# Altium schematic sheet Peripherals.SchDoc
size C; SheetNumber: 4; SheetTotal: 4
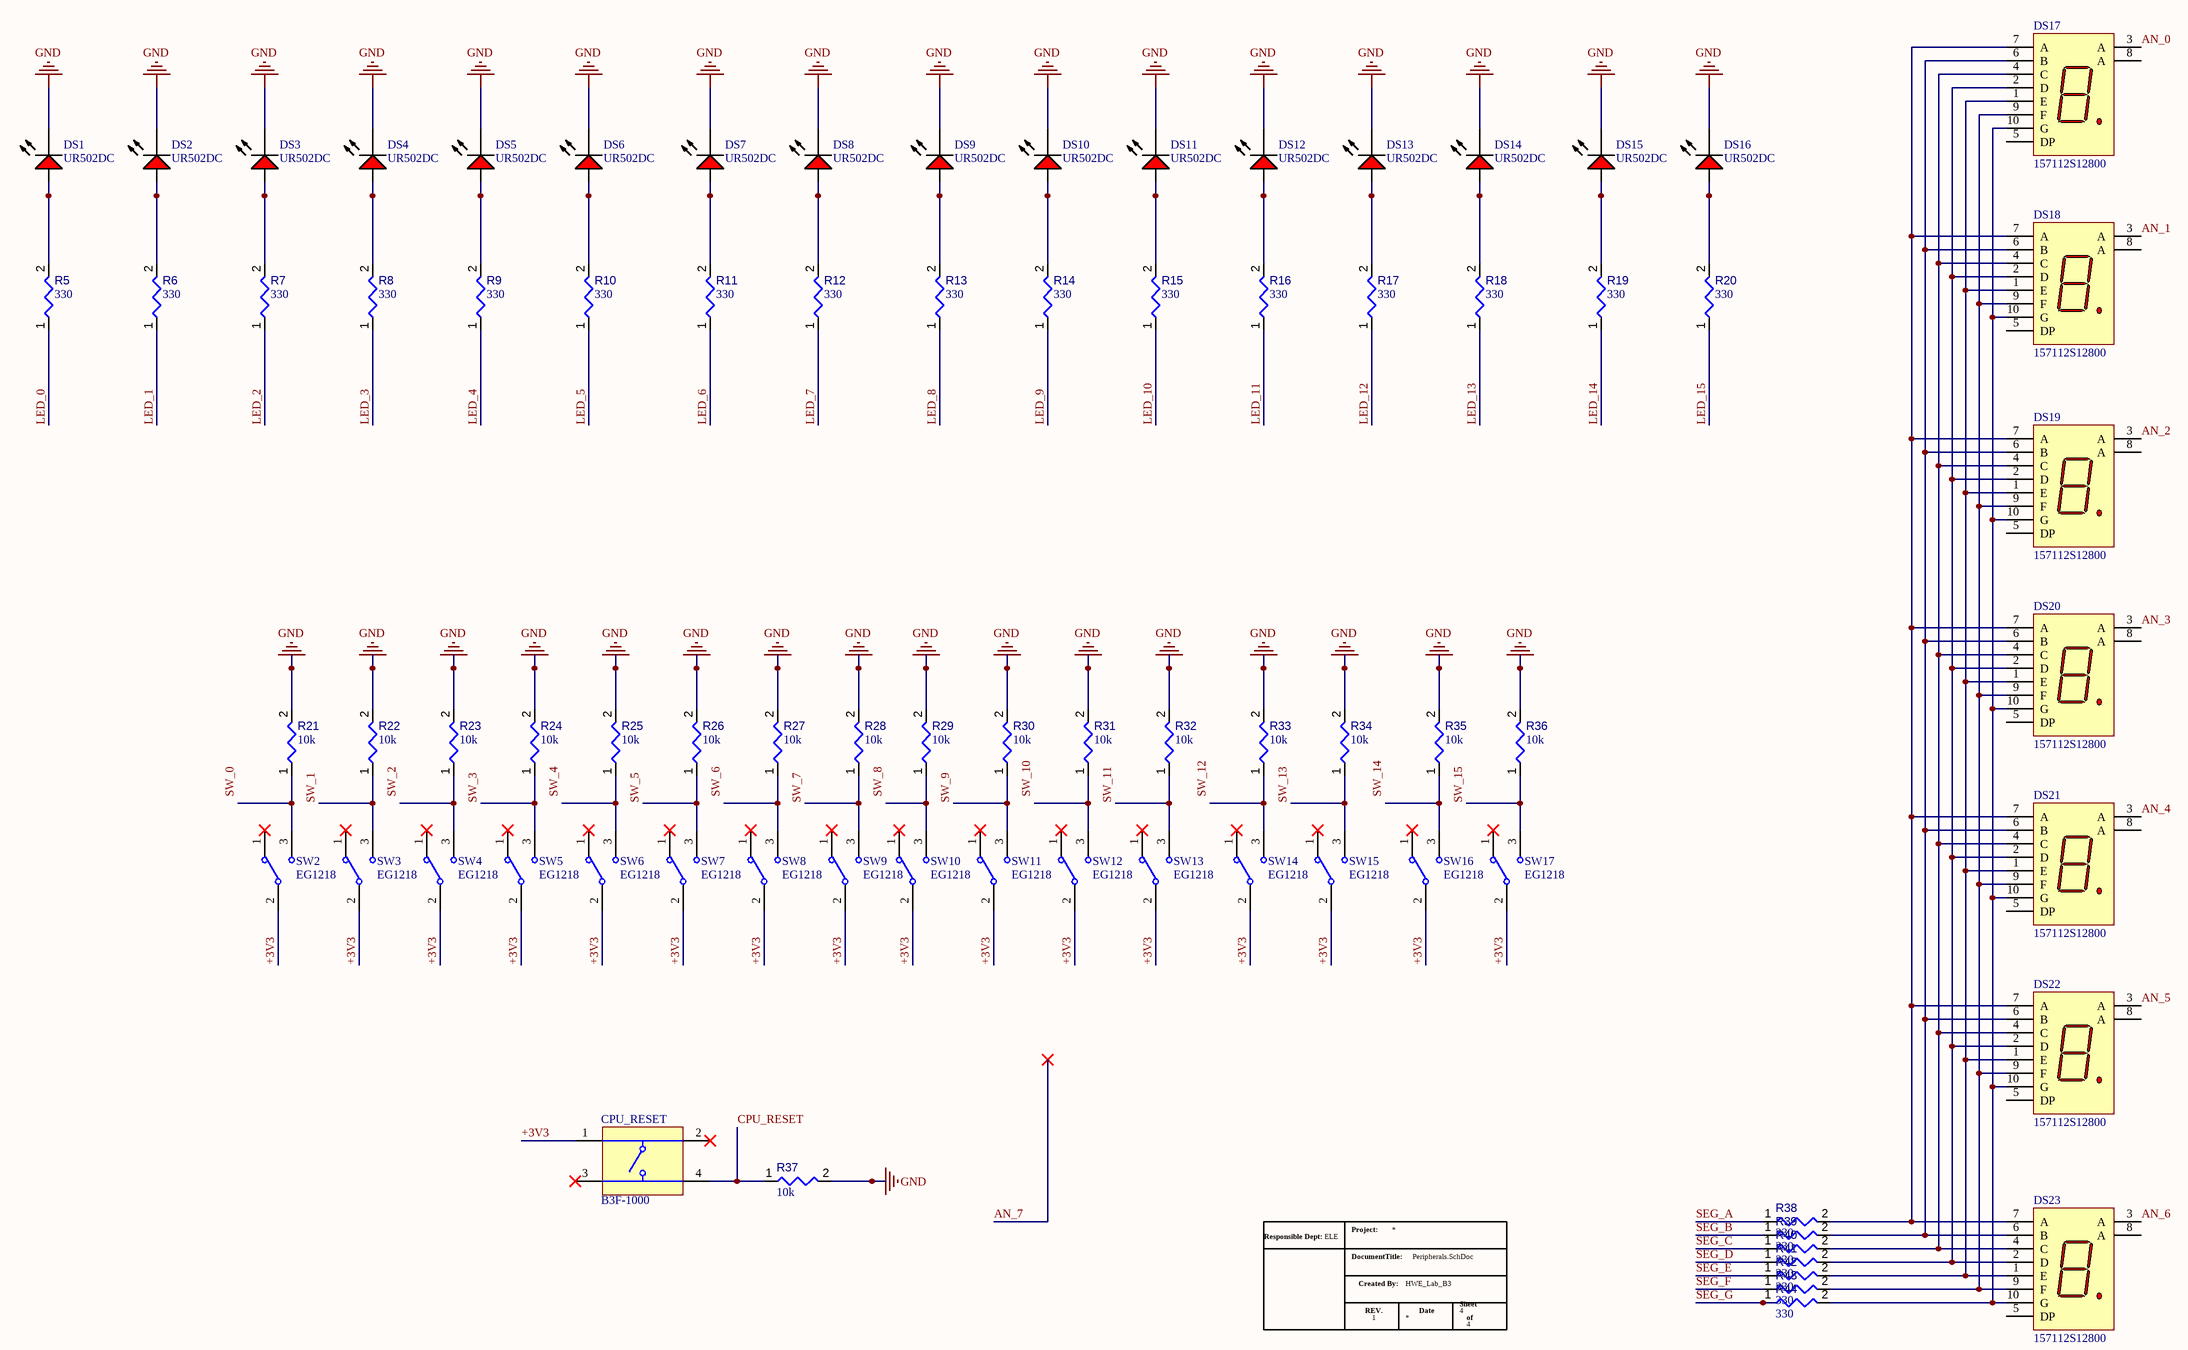
[diagram p0: Peripherals.SchDoc]

## Parts
*  8Bit_CPU  (value not drawn)  (graphical)
CPU_RESET  B3F-1000  [OMRON-B3F-1000-4_V]
DS1  UR502DC  [CGX-UR502DC]
DS2  UR502DC  [CGX-UR502DC]
DS3  UR502DC  [CGX-UR502DC]
DS4  UR502DC  [CGX-UR502DC]
DS5  UR502DC  [CGX-UR502DC]
DS6  UR502DC  [CGX-UR502DC]
DS7  UR502DC  [CGX-UR502DC]
DS8  UR502DC  [CGX-UR502DC]
DS9  UR502DC  [CGX-UR502DC]
DS10  UR502DC  [CGX-UR502DC]
DS11  UR502DC  [CGX-UR502DC]
DS12  UR502DC  [CGX-UR502DC]
DS13  UR502DC  [CGX-UR502DC]
DS14  UR502DC  [CGX-UR502DC]
DS15  UR502DC  [CGX-UR502DC]
DS16  UR502DC  [CGX-UR502DC]
DS17  157112S12800  [WL-S7DS_L12W7.3H3.75]
DS18  157112S12800  [WL-S7DS_L12W7.3H3.75]
DS19  157112S12800  [WL-S7DS_L12W7.3H3.75]
DS20  157112S12800  [WL-S7DS_L12W7.3H3.75]
DS21  157112S12800  [WL-S7DS_L12W7.3H3.75]
DS22  157112S12800  [WL-S7DS_L12W7.3H3.75]
DS23  157112S12800  [WL-S7DS_L12W7.3H3.75]
R5  value 330  [RESC0402(1005)_L]  (hidden comment: Resistor 330R +/-5 % 0402 63 mW)
R6  value 330  [RESC0402(1005)_L]  (hidden comment: Resistor 330R +/-5 % 0402 63 mW)
R7  value 330  [RESC0402(1005)_L]  (hidden comment: Resistor 330R +/-5 % 0402 63 mW)
R8  value 330  [RESC0402(1005)_L]  (hidden comment: Resistor 330R +/-5 % 0402 63 mW)
R9  value 330  [RESC0402(1005)_L]  (hidden comment: Resistor 330R +/-5 % 0402 63 mW)
R10  value 330  [RESC0402(1005)_L]  (hidden comment: Resistor 330R +/-5 % 0402 63 mW)
R11  value 330  [RESC0402(1005)_L]  (hidden comment: Resistor 330R +/-5 % 0402 63 mW)
R12  value 330  [RESC0402(1005)_L]  (hidden comment: Resistor 330R +/-5 % 0402 63 mW)
R13  value 330  [RESC0402(1005)_L]  (hidden comment: Resistor 330R +/-5 % 0402 63 mW)
R14  value 330  [RESC0402(1005)_L]  (hidden comment: Resistor 330R +/-5 % 0402 63 mW)
R15  value 330  [RESC0402(1005)_L]  (hidden comment: Resistor 330R +/-5 % 0402 63 mW)
R16  value 330  [RESC0402(1005)_L]  (hidden comment: Resistor 330R +/-5 % 0402 63 mW)
R17  value 330  [RESC0402(1005)_L]  (hidden comment: Resistor 330R +/-5 % 0402 63 mW)
R18  value 330  [RESC0402(1005)_L]  (hidden comment: Resistor 330R +/-5 % 0402 63 mW)
R19  value 330  [RESC0402(1005)_L]  (hidden comment: Resistor 330R +/-5 % 0402 63 mW)
R20  value 330  [RESC0402(1005)_L]  (hidden comment: Resistor 330R +/-5 % 0402 63 mW)
R21  value 10k  [RESC0402(1005)_L]  (hidden comment: 10KR2F)
R22  value 10k  [RESC0402(1005)_L]  (hidden comment: 10KR2F)
R23  value 10k  [RESC0402(1005)_L]  (hidden comment: 10KR2F)
R24  value 10k  [RESC0402(1005)_L]  (hidden comment: 10KR2F)
R25  value 10k  [RESC0402(1005)_L]  (hidden comment: 10KR2F)
R26  value 10k  [RESC0402(1005)_L]  (hidden comment: 10KR2F)
R27  value 10k  [RESC0402(1005)_L]  (hidden comment: 10KR2F)
R28  value 10k  [RESC0402(1005)_L]  (hidden comment: 10KR2F)
R29  value 10k  [RESC0402(1005)_L]  (hidden comment: 10KR2F)
R30  value 10k  [RESC0402(1005)_L]  (hidden comment: 10KR2F)
R31  value 10k  [RESC0402(1005)_L]  (hidden comment: 10KR2F)
R32  value 10k  [RESC0402(1005)_L]  (hidden comment: 10KR2F)
R33  value 10k  [RESC0402(1005)_L]  (hidden comment: 10KR2F)
R34  value 10k  [RESC0402(1005)_L]  (hidden comment: 10KR2F)
R35  value 10k  [RESC0402(1005)_L]  (hidden comment: 10KR2F)
R36  value 10k  [RESC0402(1005)_L]  (hidden comment: 10KR2F)
R37  value 10k  [RESC0402(1005)_L]  (hidden comment: 10KR2F)
R38  value 330  [RESC0402(1005)_L]  (hidden comment: Resistor 330R +/-5 % 0402 63 mW)
R39  value 330  [RESC0402(1005)_L]  (hidden comment: Resistor 330R +/-5 % 0402 63 mW)
R40  value 330  [RESC0402(1005)_L]  (hidden comment: Resistor 330R +/-5 % 0402 63 mW)
R41  value 330  [RESC0402(1005)_L]  (hidden comment: Resistor 330R +/-5 % 0402 63 mW)
R42  value 330  [RESC0402(1005)_L]  (hidden comment: Resistor 330R +/-5 % 0402 63 mW)
R43  value 330  [RESC0402(1005)_L]  (hidden comment: Resistor 330R +/-5 % 0402 63 mW)
R44  value 330  [RESC0402(1005)_L]  (hidden comment: Resistor 330R +/-5 % 0402 63 mW)
SW2  EG1218  [ESWI-EG1218_V]
SW3  EG1218  [ESWI-EG1218_V]
SW4  EG1218  [ESWI-EG1218_V]
SW5  EG1218  [ESWI-EG1218_V]
SW6  EG1218  [ESWI-EG1218_V]
SW7  EG1218  [ESWI-EG1218_V]
SW8  EG1218  [ESWI-EG1218_V]
SW9  EG1218  [ESWI-EG1218_V]
SW10  EG1218  [ESWI-EG1218_V]
SW11  EG1218  [ESWI-EG1218_V]
SW12  EG1218  [ESWI-EG1218_V]
SW13  EG1218  [ESWI-EG1218_V]
SW14  EG1218  [ESWI-EG1218_V]
SW15  EG1218  [ESWI-EG1218_V]
SW16  EG1218  [ESWI-EG1218_V]
SW17  EG1218  [ESWI-EG1218_V]

## Nets
GND: DS1.2(K) DS2.2(K) DS3.2(K) DS4.2(K) DS5.2(K) DS6.2(K) DS7.2(K) DS8.2(K) DS9.2(K) DS10.2(K) DS11.2(K) DS12.2(K) DS13.2(K) DS14.2(K) DS15.2(K) DS16.2(K) R21.2 R22.2 R23.2 R24.2 R25.2 R26.2 R27.2 R28.2 R29.2 R30.2 R31.2 R32.2 R33.2 R34.2 R35.2 R36.2 R37.2
  SW_0: R21.1 SW2.3
  SW_2: R23.1 SW4.3
  SW_4: R25.1 SW6.3
  SW_6: R27.1 SW8.3
  SW_8: R29.1 SW10.3
  SW_10: R31.1 SW12.3
  SW_12: R33.1 SW14.3
  SW_14: R35.1 SW16.3
+3V3: CPU_RESET.1 SW2.2(COM) SW3.2(COM) SW4.2(COM) SW5.2(COM) SW6.2(COM) SW7.2(COM) SW8.2(COM) SW9.2(COM) SW10.2(COM) SW11.2(COM) SW12.2(COM) SW13.2(COM) SW14.2(COM) SW15.2(COM) SW16.2(COM) SW17.2(COM)
AN_0: DS17.3(A)
AN_1: DS18.3(A)
AN_2: DS19.3(A)
AN_3: DS20.3(A)
AN_4: DS21.3(A)
AN_5: DS22.3(A)
AN_6: DS23.3(A)
CPU_RESET: CPU_RESET.4 R37.1
LED_0: R5.1
LED_1: R6.1
LED_2: R7.1
LED_3: R8.1
LED_4: R9.1
LED_5: R10.1
LED_6: R11.1
LED_7: R12.1
LED_8: R13.1
LED_9: R14.1
LED_10: R15.1
LED_11: R16.1
LED_12: R17.1
LED_13: R18.1
LED_14: R19.1
LED_15: R20.1
SEG_A: R38.1
SEG_B: R39.1
SEG_C: R40.1
SEG_D: R41.1
SEG_E: R42.1
SEG_F: R43.1
SEG_G: R44.1
SW_1: R22.1 SW3.3
SW_3: R24.1 SW5.3
SW_5: R26.1 SW7.3
SW_7: R28.1 SW9.3
SW_9: R30.1 SW11.3
SW_11: R32.1 SW13.3
SW_13: R34.1 SW15.3
SW_15: R36.1 SW17.3
NetDS1_1: DS1.1(A) R5.2
NetDS2_1: DS2.1(A) R6.2
NetDS3_1: DS3.1(A) R7.2
NetDS4_1: DS4.1(A) R8.2
NetDS5_1: DS5.1(A) R9.2
NetDS6_1: DS6.1(A) R10.2
NetDS7_1: DS7.1(A) R11.2
NetDS8_1: DS8.1(A) R12.2
NetDS9_1: DS9.1(A) R13.2
NetDS10_1: DS10.1(A) R14.2
NetDS11_1: DS11.1(A) R15.2
NetDS12_1: DS12.1(A) R16.2
NetDS13_1: DS13.1(A) R17.2
NetDS14_1: DS14.1(A) R18.2
NetDS15_1: DS15.1(A) R19.2
NetDS16_1: DS16.1(A) R20.2
NetDS17_1: DS17.1(E) DS18.1(E) DS19.1(E) DS20.1(E) DS21.1(E) DS22.1(E) DS23.1(E) R42.2
NetDS17_2: DS17.2(D) DS18.2(D) DS19.2(D) DS20.2(D) DS21.2(D) DS22.2(D) DS23.2(D) R41.2
NetDS17_4: DS17.4(C) DS18.4(C) DS19.4(C) DS20.4(C) DS21.4(C) DS22.4(C) DS23.4(C) R40.2
NetDS17_6: DS17.6(B) DS18.6(B) DS19.6(B) DS20.6(B) DS21.6(B) DS22.6(B) DS23.6(B) R39.2
NetDS17_7: DS17.7(A) DS18.7(A) DS19.7(A) DS20.7(A) DS21.7(A) DS22.7(A) DS23.7(A) R38.2
NetDS17_9: DS17.9(F) DS18.9(F) DS19.9(F) DS20.9(F) DS21.9(F) DS22.9(F) DS23.9(F) R43.2
NetDS17_10: DS17.10(G) DS18.10(G) DS19.10(G) DS20.10(G) DS21.10(G) DS22.10(G) DS23.10(G) R44.2

Not connected (* = marked no-connect by the designer): CPU_RESET 2* 3*; DS17 5(DP) 8(A); DS18 5(DP) 8(A); DS19 5(DP) 8(A); DS20 5(DP) 8(A); DS21 5(DP) 8(A); DS22 5(DP) 8(A); DS23 5(DP) 8(A); SW2 1*; SW3 1*; SW4 1*; SW5 1*; SW6 1*; SW7 1*; SW8 1*; SW9 1*; SW10 1*; SW11 1*; SW12 1*; SW13 1*; SW14 1*; SW15 1*; SW16 1*; SW17 1*

## Notes on the sheet
- (in symbol 8Bit_CPU) Project:; Responsible Dept:; ELE; DocumentTitle:; Created By:; HWE_Lab_B3; Sheet; REV.; Date; 1; of

## Library data of the parts
CPU_RESET = CMP-1677-00002-1: Tactile Switch, SPST-NO, 0.05 A, 5 to 24 V, -25 to 70 degC, 4-Pin THD, RoHS, Bulk; Shielding: Shielded; Gender: Female; Capacitance: -45 f; Voltage Rating: 150 V; Current Rating: 1.5 A; Radiation Hardening: No; Contact Plating: Gold; Height: 14.99 mm; Min Operating Temperature: -40 degC; Packaging: Tray; ComponentLink2Description: Datasheet; ComponentLink1URL: http://www.omron.com/; Lead Pitch: 1.27 mm; RoHSCompliant: true; Pins: 8; PackageReference: B3F-1000; Width: 25.4 mm; Contact Material: Brass; ComponentLink2URL: http://www.omron.com/ecb/products/pdf/en-b3f.pdf; PackageDescription: 4-Pin Through Hole Device, Body 6 x 6 mm; DatasheetVersion: Jan-15; ComponentLink1Description: Manufacturer URL; Package Quantity: 1080; Mount: Through Hole; Length: 18.34 mm; Max Operating Temperature: 70 degC
DS1-DS16 = CMP-007-00009-2: Red LED, 80 mW, 30 mA, -25 to 85 degC, 2-Pin THD; Manufacturer: Shenzhen CGX; Power: 80mW; Case/Package: UR502DC; RoHS Compliant: Unknown; Package Description: 2-Pin Through Hole Device, Dia 5.9 mm, Height 9.1 mm; Manufacturer URL: http://szcgx.com/; Datasheet Version: Sep-14; Package Reference: UR502DC; Datasheet URL: http://datasheet.octopart.com/UR502DC-Chengguangxing-datasheet-62330342.pdf; Mounting Technology: TH
DS17-DS23 = CMP-03913-119893987-3: 7-Seg Display, Comm Anode, Super Red Rohs Compliant: Yes; Forward Voltage: 2V; Dominant Wavelength: 635nm; Forward Current: 100mA; Luminous Intensity: 15mcd; Max Reverse Voltage (DC): 5V; Height: 3.75mm; Width: 7.3mm; Max Operating Temperature: 85°C; Length: 12mm; RoHS: Compliant; Min Operating Temperature: -35°C
R5-R20 R38-R44 = CMP-009-00132-3: Chip Resistor, 330 Ohms, +/-5 %, 63 mW, -55 to 155 degC, 0402; Power: 63mW; Tolerance: 5%; Pins: 2; Max Operating Temperature: 155°C; Min Operating Temperature: -55°C; Case/Package: 0402
R21-R37 = CMP-009-00066-2: 10K 0.063W 1% 0402 (1005 Metric)  SMD; Power: 63mW; Case/Package: 0402; Mounting Technology: SMT; Pins: 2; Tolerance: 1%
SW2-SW17 = CMP-011-00006-2: Slide Switch, SPDT, 500 V, -20 to 70 degC, 3-Pin THD, RoHS, Bulk; Manufacturer: E-Switch; Voltage Rating (DC): 30V; Current Rating: 200mA; Operating Force: 250gf; Package Quantity: 1000; Contact Plating: Silver; Max Operating Temperature: 70°C; Min Operating Temperature: -20°C; Contact Material: Copper; Datasheet URL: https://www.e-switch.com/system/asset/product_line/data_sheet/119/EG.pdf; Contact Finish: Silver; Case/Package: EG1218; Voltage Rating (AC): 30V; Datasheet Version: Oct-15; Package Description: 3-Pin Through Hole Device, Body 11.6 x 4 mm, Pitch 2.5 mm; RoHS Compliant: True; Package Reference: EG1218; Manufacturer URL: http://www.e-switch.ch/en/; Throw Configuration: SPDT; Contact Current Rating: 200mA; Mounting Technology: TH; Packaging: Bulk; Pins: 3